# EAGLE design Small-BEC-5V (EAGLE 9.2.2)
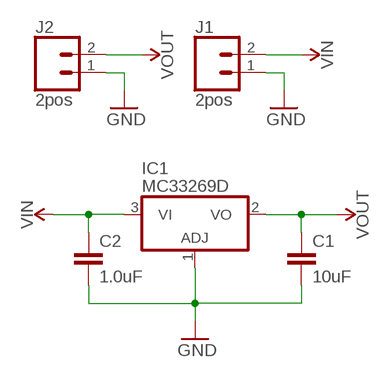
[diagram p0: schematic, sheet 1]

## Parts
C1  10uF  10UF-0805-10V-10%  [0805]
C2  1.0uF  1.0UF-0805-25V-10%  [0805]
IC1  MC33269D  [DPACK]
J1  2pos  CONN_02  [1X02]
J2  2pos  CONN_02  [1X02]

## Nets
GND: C1.2 C2.2 IC1.1(ADJ) J1.1 J2.1
VIN: C2.1 IC1.3(VI) J1.2
VOUT: C1.1 IC1.2(VO) J2.2

## Library data of the parts
C1 = SparkFun-Capacitors:10UF: 10.0µF ceramic capacitors A capacitor is a passive two-terminal electrical component used to store electrical energy temporarily in an electric field.; PROD_ID: CAP-11330
C2 = SparkFun-Capacitors:1.0UF: 1µF ceramic capacitors A capacitor is a passive two-terminal electrical component used to store electrical energy temporarily in an electric field.; PROD_ID: CAP-08064
IC1 = linear:MC33269?*: Adjustable Output Low Dropout Voltage Regulator 800 mA Source: http://www.onsemi.com/pub/Collateral/MC33269-D.PDF
J1 J2 = SparkFun-Connectors:CONN_02: Multi connection point. Often used as Generic Header-pin footprint for 0.1 inch spaced/style header connections On any of the 0.1 inch spaced packages, you can populate with these: Break Away Headers - Straight <https://www.sparkfun.com/products/116> (PRT-00116) Break Away Male Headers - Right Angle <https://www.sparkfun.com/products/553> (PRT-00553) Female Headers <https://www.sparkfun.com/products/115> (PRT-00115) Break Away Headers - Machine Pin <https://www.sparkfun.com/products/117> (PRT-00117) Break Away Female Headers - Swiss Machine Pin <https://www.sparkfun.com/products/743> (PRT-00743) For SCREWTERMINALS and SPRING TERMINALS visit here: Screw Terimnals on SparkFun.com <https://www.sparkfun.com/search/results?term=Screw+Terminals> (5mm/3.5mm/2.54mm spacing) This device is also useful as a general connection point to wire up your design to another part of your project. Our various solder wires solder well into these plated through hole pads. Hook-Up Wire - Assortment (Stranded, 22 AWG) <https://www.sparkfun.com/products/11375> (PRT-11375) Hook-Up Wire - Assortment (Solid Core, 22 AWG) <https://www.sparkfun.com/products/11367> (PRT-11367) View the entire wire category on our website here <https://www.sparkfun.com/categories/141> Special notes: Molex polarized connector foot print use with: PRT-08233 with associated crimp pins and housings. 2.54_SCREWTERM for use with PRT-10571. 3.5mm Screw Terminal footprints for PRT-08084 5mm Screw Terminal footprints for use with PRT-08432

## Board
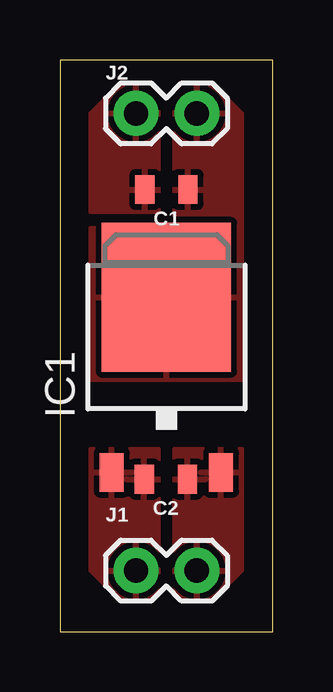
[diagram p1: board, top side]
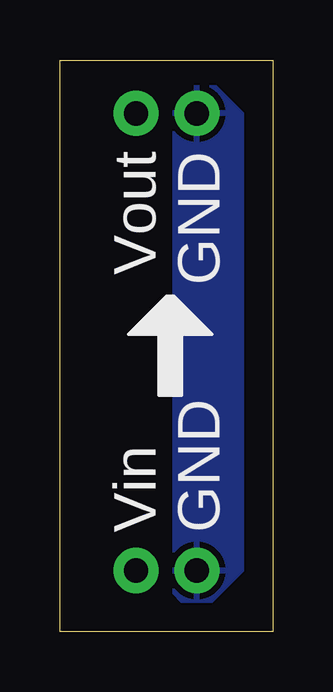
[diagram p2: board, bottom side, seen from below]

Size 8.89 x 23.81 mm. Coordinates in mm from the lower left corner, seen from the top.
Outline: 0,0 8.89,0 8.89,23.81 0,23.81 0,0
Copper layers (1*16): Top 0.035mm / dielectric 1.5mm / Bottom 0.035mm
Design rules "default": minimum track width 6mil, minimum drill 0.35mm, track to track 6mil, track to pad 6mil, pad to pad 6mil, via to via 6mil, smd to smd 6mil, copper to edge 40mil, drill to drill 6mil, minimum pad ring 10mil, minimum via ring 8mil, stop-mask expansion 4mil, vias tented up to drill 0mil, thermal gap 10mil

### Footprints (pad centres in the part's own frame; a part is rotated, then mirrored left to right if it is on the bottom)
0805 = smd 0.8 x 1.2: 1 -0.9,0; 2 0.9,0
DPACK = smd 1 x 1.6: 1 -2.28,-4.8; 3 2.28,-4.8 | smd 5.4 x 6.2: 2 0,2.5
1X02 = drill 1.016 pad 1.88: 1 0,0; 2 2.54,0

### Placement (x,y rotation side)
C1  4.45,18.41 180 top
C2  4.42,6.35 180 top
IC1  4.45,11.43 0 top
J1  3.17,2.54 0 top
J2  3.17,21.59 0 top

### Tracks (layer width: path | path; a pad name or v marks a point on that pad's centre or on a via)
GND
  pour Top: 1.27,7.62 4.13,7.62 4.13,1.59 3.81,1.27 2.54,1.27 1.27,2.54
  pour Top: 4.13,22.54 3.81,22.86 2.54,22.86 1.27,21.59 1.27,17.46 4.13,17.46
  pour Bottom: 4.13,22.54 3.81,22.86 2.54,22.86 1.27,21.59 1.27,2.54 2.54,1.27 3.81,1.27 4.13,1.59
VIN
  pour Top: 4.76,3.49 4.76,1.59 5.08,1.27 6.35,1.27 7.62,2.54 7.62,7.62 4.76,7.62
VOUT
  pour Top: 4.76,22.54 5.08,22.86 6.35,22.86 7.62,21.59 7.62,10.48 1.27,10.48 1.27,16.83 4.76,16.83

### Text on the board
bPlace: Vout / GND | Vin / GND